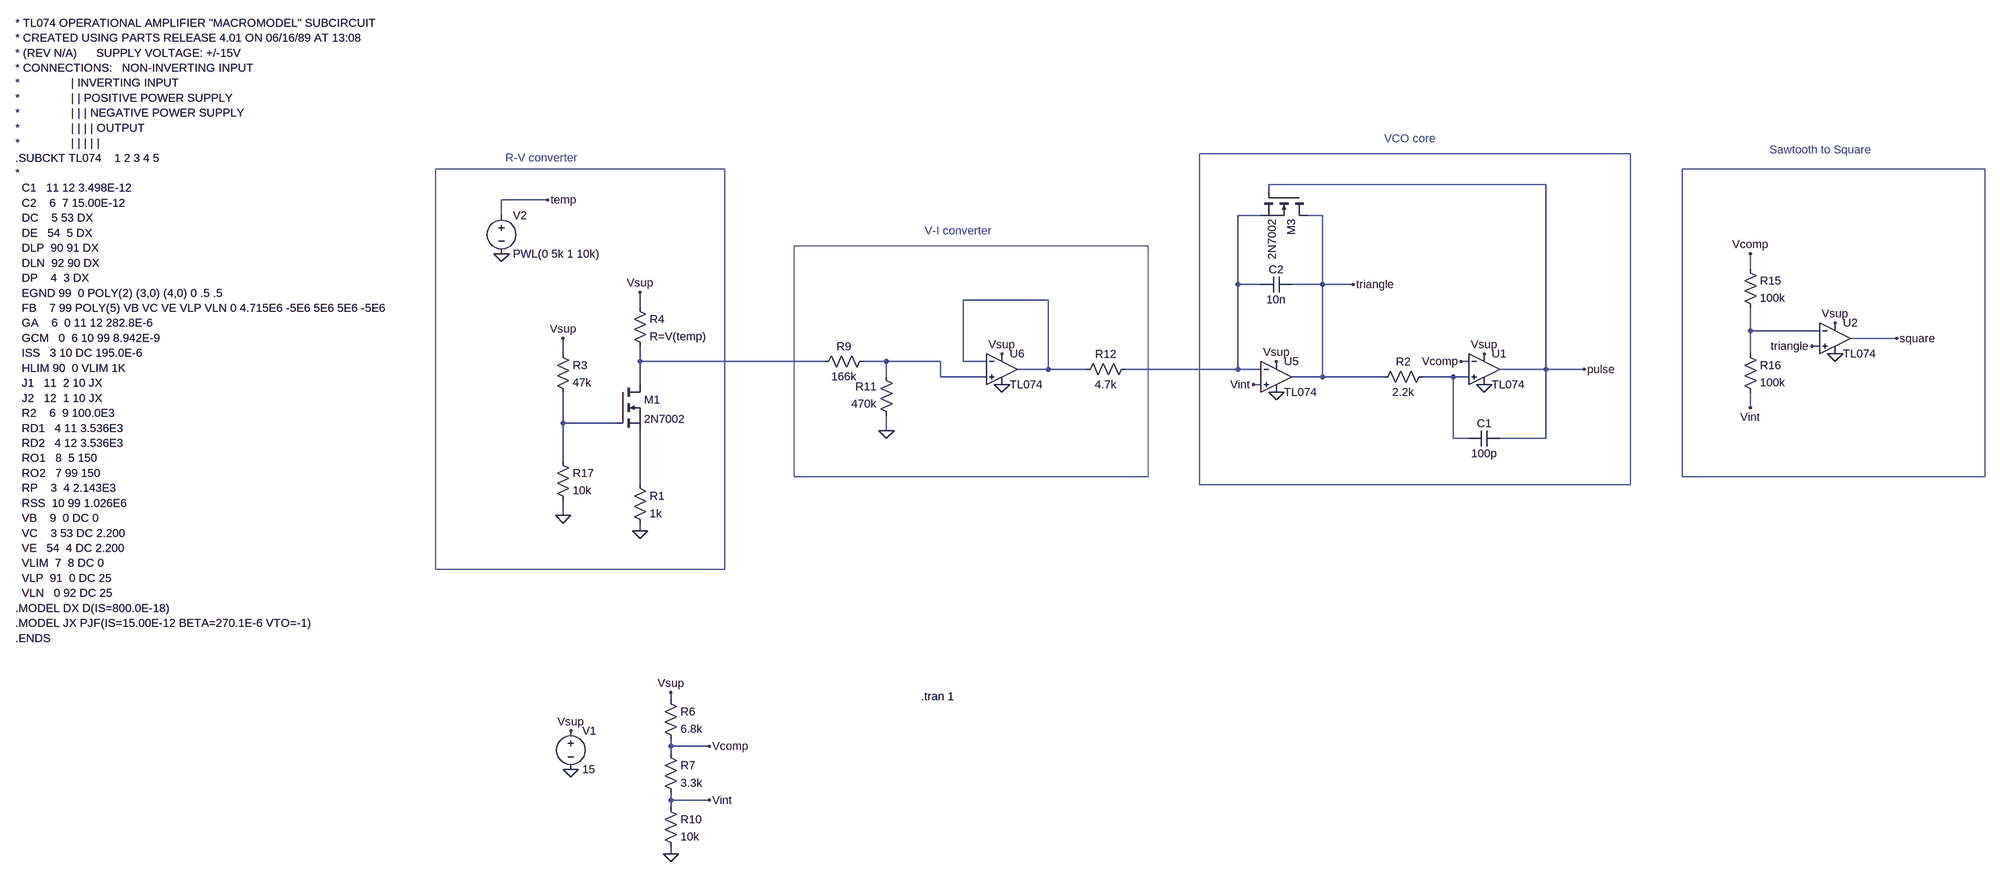
[diagram p0: schematic fgenmos.asc]
fgenmos.asc, the LTspice schematic file:
Version 4
SHEET 1 3508 2900
WIRE 1936 816 1360 816
WIRE 1360 832 1360 816
WIRE -160 848 -256 848
WIRE -256 880 -256 848
WIRE 1344 880 1296 880
WIRE 1472 880 1440 880
WIRE 2448 992 2448 960
WIRE 1296 1024 1296 880
WIRE 1344 1024 1296 1024
WIRE 1472 1024 1472 880
WIRE 1472 1024 1408 1024
WIRE 1536 1024 1472 1024
WIRE 880 1056 704 1056
WIRE 32 1072 32 1040
WIRE 2448 1120 2448 1072
WIRE 2592 1120 2448 1120
WIRE 2752 1136 2656 1136
WIRE 2592 1152 2576 1152
WIRE -128 1168 -128 1136
WIRE 2448 1168 2448 1120
WIRE 32 1184 32 1152
WIRE 416 1184 32 1184
WIRE 544 1184 496 1184
WIRE 656 1184 544 1184
WIRE 704 1184 704 1056
WIRE 752 1184 704 1184
WIRE 1776 1184 1760 1184
WIRE 880 1200 880 1056
WIRE 880 1200 816 1200
WIRE 960 1200 880 1200
WIRE 1296 1200 1296 1024
WIRE 1296 1200 1040 1200
WIRE 1344 1200 1296 1200
WIRE 1936 1200 1936 816
WIRE 1936 1200 1840 1200
WIRE 2016 1200 1936 1200
WIRE 544 1216 544 1184
WIRE 656 1216 656 1184
WIRE 752 1216 656 1216
WIRE 1472 1216 1472 1024
WIRE 1472 1216 1408 1216
WIRE 1600 1216 1472 1216
WIRE 1744 1216 1680 1216
WIRE 1776 1216 1744 1216
WIRE 32 1232 32 1184
WIRE 1344 1232 1328 1232
WIRE 2448 1280 2448 1248
WIRE -128 1312 -128 1248
WIRE -16 1312 -128 1312
WIRE 544 1328 544 1296
WIRE 1744 1344 1744 1216
WIRE 1776 1344 1744 1344
WIRE 1936 1344 1936 1200
WIRE 1936 1344 1840 1344
WIRE -128 1392 -128 1312
WIRE 32 1440 32 1328
WIRE -128 1504 -128 1472
WIRE 32 1536 32 1520
WIRE 96 1888 96 1872
WIRE 96 1984 96 1968
WIRE 176 1984 96 1984
WIRE 96 2000 96 1984
WIRE 96 2096 96 2080
WIRE 176 2096 96 2096
WIRE 96 2112 96 2096
WIRE 96 2208 96 2192
FLAG -112 2032 0
FLAG -112 1952 Vsup
FLAG 176 2096 Vint
FLAG 96 1872 Vsup
FLAG 1376 1184 Vsup
FLAG 1376 1248 0
FLAG 1328 1232 Vint
FLAG 1808 1168 Vsup
FLAG 1808 1232 0
FLAG 2016 1200 pulse
FLAG 32 1040 Vsup
FLAG -256 960 0
FLAG -160 848 temp
FLAG 32 1536 0
FLAG 784 1168 Vsup
FLAG 784 1232 0
FLAG 544 1328 0
FLAG 96 2208 0
FLAG 176 1984 Vcomp
FLAG 1760 1184 Vcomp
FLAG 1536 1024 triangle
FLAG 2624 1104 Vsup
FLAG 2624 1168 0
FLAG 2752 1136 square
FLAG 2576 1152 triangle
FLAG 2448 960 Vcomp
FLAG 2448 1280 Vint
FLAG -128 1504 0
FLAG -128 1136 Vsup
DATAFLAG 96 1984 ""
DATAFLAG 96 2096 ""
DATAFLAG 2448 1120 ""
SYMBOL voltage -112 1936 R0
WINDOW 123 0 0 Left 0
WINDOW 39 0 0 Left 0
SYMATTR InstName V1
SYMATTR Value 15
SYMBOL OpAmps\\opamp2 1376 1152 R0
SYMATTR InstName U5
SYMATTR Value TL074
SYMBOL cap 1408 1008 R90
WINDOW 0 0 32 VBottom 2
WINDOW 3 32 32 VTop 2
SYMATTR InstName C2
SYMATTR Value 10n
SYMBOL OpAmps\\opamp2 1808 1136 R0
SYMATTR InstName U1
SYMATTR Value TL074
SYMBOL res 1696 1200 R90
WINDOW 0 0 56 VBottom 2
WINDOW 3 32 56 VTop 2
SYMATTR InstName R2
SYMATTR Value 2.2k
SYMBOL res 16 1056 R0
SYMATTR InstName R4
SYMATTR Value R=V(temp)
SYMBOL voltage -256 864 R0
WINDOW 123 0 0 Left 0
WINDOW 39 0 0 Left 0
SYMATTR InstName V2
SYMATTR Value PWL(0 5k 1 10k)
SYMBOL res 16 1424 R0
SYMATTR InstName R1
SYMATTR Value 1k
SYMBOL OpAmps\\opamp2 784 1136 R0
SYMATTR InstName U6
SYMATTR Value TL074
SYMBOL res 1056 1184 R90
WINDOW 0 0 56 VBottom 2
WINDOW 3 32 56 VTop 2
SYMATTR InstName R12
SYMATTR Value 4.7k
SYMBOL res 512 1168 R90
WINDOW 0 0 56 VBottom 2
WINDOW 3 32 56 VTop 2
SYMATTR InstName R9
SYMATTR Value 166k
SYMBOL res 560 1312 R180
WINDOW 0 36 76 Left 2
WINDOW 3 36 40 Left 2
SYMATTR InstName R11
SYMATTR Value 470k
SYMBOL nmos -16 1232 R0
SYMATTR InstName M1
SYMATTR Value 2N7002
SYMBOL nmos 1440 832 R90
SYMATTR InstName M3
SYMATTR Value 2N7002
SYMBOL res 80 1872 R0
SYMATTR InstName R6
SYMATTR Value 6.8k
SYMBOL res 80 1984 R0
SYMATTR InstName R7
SYMATTR Value 3.3k
SYMBOL res 80 2096 R0
SYMATTR InstName R10
SYMATTR Value 10k
SYMBOL OpAmps\\opamp2 2624 1072 R0
SYMATTR InstName U2
SYMATTR Value TL074
SYMBOL res 2432 976 R0
SYMATTR InstName R15
SYMATTR Value 100k
SYMBOL res 2432 1152 R0
SYMATTR InstName R16
SYMATTR Value 100k
SYMBOL cap 1840 1328 R90
WINDOW 0 0 32 VBottom 2
WINDOW 3 32 32 VTop 2
SYMATTR InstName C1
SYMATTR Value 100p
SYMBOL res -144 1152 R0
SYMATTR InstName R3
SYMATTR Value 47k
SYMBOL res -144 1376 R0
SYMATTR InstName R17
SYMATTR Value 10k
TEXT -1568 480 Left 2 !* TL074 OPERATIONAL AMPLIFIER "MACROMODEL" SUBCIRCUIT\n* CREATED USING PARTS RELEASE 4.01 ON 06/16/89 AT 13:08\n* (REV N/A)      SUPPLY VOLTAGE: +/-15V\n* CONNECTIONS:   NON-INVERTING INPUT\n*                | INVERTING INPUT\n*                | | POSITIVE POWER SUPPLY\n*                | | | NEGATIVE POWER SUPPLY\n*                | | | | OUTPUT\n*                | | | | |\n.SUBCKT TL074    1 2 3 4 5\n*\n  C1   11 12 3.498E-12\n  C2    6  7 15.00E-12\n  DC    5 53 DX\n  DE   54  5 DX\n  DLP  90 91 DX\n  DLN  92 90 DX\n  DP    4  3 DX\n  EGND 99  0 POLY(2) (3,0) (4,0) 0 .5 .5\n  FB    7 99 POLY(5) VB VC VE VLP VLN 0 4.715E6 -5E6 5E6 5E6 -5E6\n  GA    6  0 11 12 282.8E-6\n  GCM   0  6 10 99 8.942E-9\n  ISS   3 10 DC 195.0E-6\n  HLIM 90  0 VLIM 1K\n  J1   11  2 10 JX\n  J2   12  1 10 JX\n  R2    6  9 100.0E3\n  RD1   4 11 3.536E3\n  RD2   4 12 3.536E3\n  RO1   8  5 150\n  RO2   7 99 150\n  RP    3  4 2.143E3\n  RSS  10 99 1.026E6\n  VB    9  0 DC 0\n  VC    3 53 DC 2.200\n  VE   54  4 DC 2.200\n  VLIM  7  8 DC 0\n  VLP  91  0 DC 25\n  VLN   0 92 DC 25\n.MODEL DX D(IS=800.0E-18)\n.MODEL JX PJF(IS=15.00E-12 BETA=270.1E-6 VTO=-1)\n.ENDS
TEXT 616 1880 Left 2 !.tran 1
TEXT -248 760 Left 2 ;R-V converter
TEXT 624 912 Left 2 ;V-I converter
TEXT 1600 720 Left 2 ;VCO core
TEXT 2488 744 Left 2 ;Sawtooth to Square
RECTANGLE Normal 208 1616 -480 784
RECTANGLE Normal 1088 1424 352 944
RECTANGLE Normal 2112 1440 1216 752
RECTANGLE Normal 2960 1424 2288 784

The netlist it stands for:
* fgenmos.asc
V1 Vsup 0 15
XU5 Vint N001 Vsup 0 triangle TL074  ; pins In+ In- V+ V- OUT
C2 triangle N001 10n
XU1 N006 Vcomp Vsup 0 pulse TL074  ; pins In+ In- V+ V- OUT
R2 N006 triangle 2.2k
R4 Vsup N004 R=V(temp)
V2 temp 0 PWL(0 5k 1 10k)
R1 N008 0 1k
XU6 N005 N002 Vsup 0 N002 TL074  ; pins In+ In- V+ V- OUT
R12 N001 N002 4.7k
R9 N005 N004 166k
R11 0 N005 470k
M1 N004 N007 N008 N008 2N7002
M3 triangle pulse N001 N001 2N7002
R6 Vsup Vcomp 6.8k
R7 Vcomp Vint 3.3k
R10 Vint 0 10k
XU2 triangle N003 Vsup 0 square TL074  ; pins In+ In- V+ V- OUT
R15 Vcomp N003 100k
R16 N003 Vint 100k
C1 pulse N006 100p
R3 Vsup N007 47k
R17 N007 0 10k
.model NMOS NMOS
.model PMOS PMOS
.lib standard.mos
* TL074 OPERATIONAL AMPLIFIER "MACROMODEL" SUBCIRCUIT
* CREATED USING PARTS RELEASE 4.01 ON 06/16/89 AT 13:08
* (REV N/A)      SUPPLY VOLTAGE: +/-15V
* CONNECTIONS:   NON-INVERTING INPUT
*                | INVERTING INPUT
*                | | POSITIVE POWER SUPPLY
*                | | | NEGATIVE POWER SUPPLY
*                | | | | OUTPUT
*                | | | | |
.SUBCKT TL074    1 2 3 4 5
*
  C1   11 12 3.498E-12
  C2    6  7 15.00E-12
  DC    5 53 DX
  DE   54  5 DX
  DLP  90 91 DX
  DLN  92 90 DX
  DP    4  3 DX
  EGND 99  0 POLY(2) (3,0) (4,0) 0 .5 .5
  FB    7 99 POLY(5) VB VC VE VLP VLN 0 4.715E6 -5E6 5E6 5E6 -5E6
  GA    6  0 11 12 282.8E-6
  GCM   0  6 10 99 8.942E-9
  ISS   3 10 DC 195.0E-6
  HLIM 90  0 VLIM 1K
  J1   11  2 10 JX
  J2   12  1 10 JX
  R2    6  9 100.0E3
  RD1   4 11 3.536E3
  RD2   4 12 3.536E3
  RO1   8  5 150
  RO2   7 99 150
  RP    3  4 2.143E3
  RSS  10 99 1.026E6
  VB    9  0 DC 0
  VC    3 53 DC 2.200
  VE   54  4 DC 2.200
  VLIM  7  8 DC 0
  VLP  91  0 DC 25
  VLN   0 92 DC 25
.MODEL DX D(IS=800.0E-18)
.MODEL JX PJF(IS=15.00E-12 BETA=270.1E-6 VTO=-1)
.ENDS
.tran 1
* R-V converter
* V-I converter
* VCO core
* Sawtooth to Square
.backanno
.end